# Altium schematic sheet Top Sheet.SchDoc: Title
size B; Organization: Midnight Sun Solar Rayce Car Team; Address1: University of Waterloo; Address2: 200 University Ave W; Address3: Waterloo, ON, Canada; Address4: N2L 3E9; Website: www.uwmidsun.com; ProjectName: ProjectName
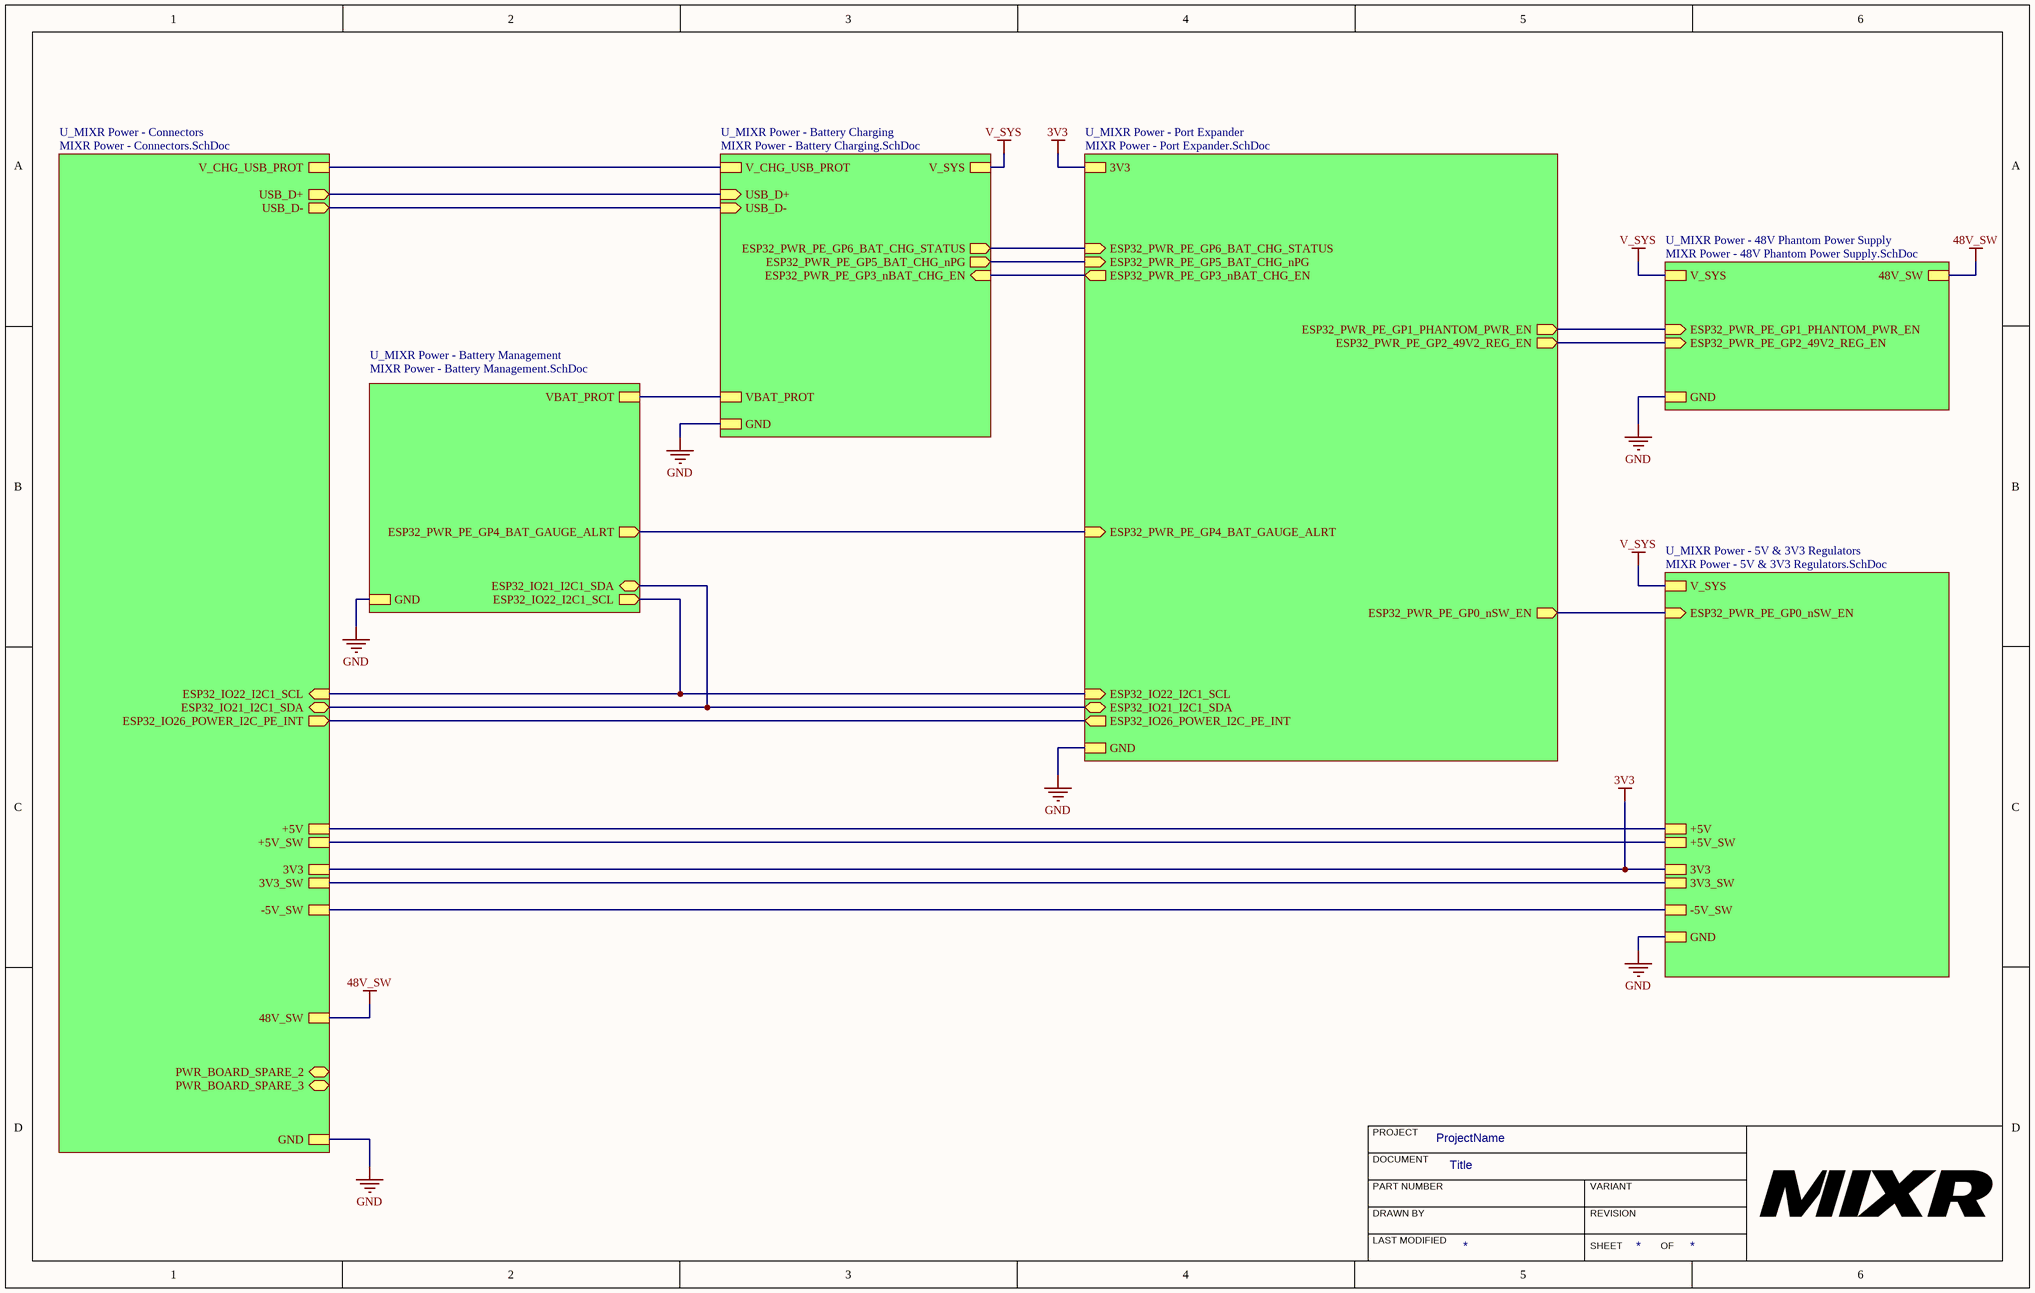
[diagram p0: Top Sheet.SchDoc]

## Sub-sheets
U_MIXR Power - 5V & 3V3 Regulators = MIXR Power - 5V & 3V3 Regulators.SchDoc: ESP32_PWR_PE_GP0_nSW_EN (in), 3V3, -5V_SW, GND, +5V, +5V_SW, 3V3_SW, V_SYS
U_MIXR Power - 48V Phantom Power Supply = MIXR Power - 48V Phantom Power Supply.SchDoc: ESP32_PWR_PE_GP1_PHANTOM_PWR_EN (in), ESP32_PWR_PE_GP2_49V2_REG_EN (in), 48V_SW, V_SYS, GND
U_MIXR Power - Battery Charging = MIXR Power - Battery Charging.SchDoc: USB_D+ (in), USB_D- (in), ESP32_PWR_PE_GP6_BAT_CHG_STATUS (out), ESP32_PWR_PE_GP3_nBAT_CHG_EN (in), ESP32_PWR_PE_GP5_BAT_CHG_nPG (out), VBAT_PROT, GND, V_CHG_USB_PROT, V_SYS
U_MIXR Power - Battery Management = MIXR Power - Battery Management.SchDoc: ESP32_PWR_PE_GP4_BAT_GAUGE_ALRT (out), ESP32_IO21_I2C1_SDA (bidir), ESP32_IO22_I2C1_SCL (out), VBAT_PROT, GND
U_MIXR Power - Connectors = MIXR Power - Connectors.SchDoc: USB_D+ (out), USB_D- (out), 3V3, GND, ESP32_IO21_I2C1_SDA (bidir), +5V, 3V3_SW, +5V_SW, -5V_SW, ESP32_IO22_I2C1_SCL (in), ESP32_IO26_POWER_I2C_PE_INT (out), V_CHG_USB_PROT, 48V_SW, PWR_BOARD_SPARE_2 (bidir), PWR_BOARD_SPARE_3 (bidir)
U_MIXR Power - Port Expander = MIXR Power - Port Expander.SchDoc: ESP32_PWR_PE_GP6_BAT_CHG_STATUS (in), ESP32_PWR_PE_GP3_nBAT_CHG_EN (out), ESP32_IO26_POWER_I2C_PE_INT (out), ESP32_IO21_I2C1_SDA (bidir), ESP32_IO22_I2C1_SCL (in), ESP32_PWR_PE_GP5_BAT_CHG_nPG (in), ESP32_PWR_PE_GP4_BAT_GAUGE_ALRT (in), ESP32_PWR_PE_GP2_49V2_REG_EN (out), ESP32_PWR_PE_GP0_nSW_EN (out), ESP32_PWR_PE_GP1_PHANTOM_PWR_EN (out), 3V3, GND

## Nets
3V3: sheet U_MIXR Power - 5V & 3V3 Regulators/3V3, sheet U_MIXR Power - Port Expander/3V3, sheet U_MIXR Power - Connectors/3V3
48V_SW: sheet U_MIXR Power - 48V Phantom Power Supply/48V_SW, sheet U_MIXR Power - Connectors/48V_SW
GND: sheet U_MIXR Power - 5V & 3V3 Regulators/GND, sheet U_MIXR Power - 48V Phantom Power Supply/GND, sheet U_MIXR Power - Battery Charging/GND, sheet U_MIXR Power - Battery Management/GND, sheet U_MIXR Power - Port Expander/GND, sheet U_MIXR Power - Connectors/GND
V_SYS: sheet U_MIXR Power - 5V & 3V3 Regulators/V_SYS, sheet U_MIXR Power - 48V Phantom Power Supply/V_SYS, sheet U_MIXR Power - Battery Charging/V_SYS
(unnamed): sheet U_MIXR Power - 5V & 3V3 Regulators/ESP32_PWR_PE_GP0_nSW_EN, sheet U_MIXR Power - Port Expander/ESP32_PWR_PE_GP0_nSW_EN
(unnamed): sheet U_MIXR Power - 5V & 3V3 Regulators/-5V_SW, sheet U_MIXR Power - Connectors/-5V_SW
(unnamed): sheet U_MIXR Power - 5V & 3V3 Regulators/+5V, sheet U_MIXR Power - Connectors/+5V
(unnamed): sheet U_MIXR Power - 5V & 3V3 Regulators/+5V_SW, sheet U_MIXR Power - Connectors/+5V_SW
(unnamed): sheet U_MIXR Power - 5V & 3V3 Regulators/3V3_SW, sheet U_MIXR Power - Connectors/3V3_SW
(unnamed): sheet U_MIXR Power - 48V Phantom Power Supply/ESP32_PWR_PE_GP1_PHANTOM_PWR_EN, sheet U_MIXR Power - Port Expander/ESP32_PWR_PE_GP1_PHANTOM_PWR_EN
(unnamed): sheet U_MIXR Power - 48V Phantom Power Supply/ESP32_PWR_PE_GP2_49V2_REG_EN, sheet U_MIXR Power - Port Expander/ESP32_PWR_PE_GP2_49V2_REG_EN
(unnamed): sheet U_MIXR Power - Battery Charging/USB_D+, sheet U_MIXR Power - Connectors/USB_D+
(unnamed): sheet U_MIXR Power - Battery Charging/USB_D-, sheet U_MIXR Power - Connectors/USB_D-
(unnamed): sheet U_MIXR Power - Battery Charging/ESP32_PWR_PE_GP6_BAT_CHG_STATUS, sheet U_MIXR Power - Port Expander/ESP32_PWR_PE_GP6_BAT_CHG_STATUS
(unnamed): sheet U_MIXR Power - Battery Charging/ESP32_PWR_PE_GP3_nBAT_CHG_EN, sheet U_MIXR Power - Port Expander/ESP32_PWR_PE_GP3_nBAT_CHG_EN
(unnamed): sheet U_MIXR Power - Battery Charging/ESP32_PWR_PE_GP5_BAT_CHG_nPG, sheet U_MIXR Power - Port Expander/ESP32_PWR_PE_GP5_BAT_CHG_nPG
(unnamed): sheet U_MIXR Power - Battery Charging/VBAT_PROT, sheet U_MIXR Power - Battery Management/VBAT_PROT
(unnamed): sheet U_MIXR Power - Battery Charging/V_CHG_USB_PROT, sheet U_MIXR Power - Connectors/V_CHG_USB_PROT
(unnamed): sheet U_MIXR Power - Battery Management/ESP32_PWR_PE_GP4_BAT_GAUGE_ALRT, sheet U_MIXR Power - Port Expander/ESP32_PWR_PE_GP4_BAT_GAUGE_ALRT
(unnamed): sheet U_MIXR Power - Battery Management/ESP32_IO21_I2C1_SDA, sheet U_MIXR Power - Port Expander/ESP32_IO21_I2C1_SDA, sheet U_MIXR Power - Connectors/ESP32_IO21_I2C1_SDA
(unnamed): sheet U_MIXR Power - Battery Management/ESP32_IO22_I2C1_SCL, sheet U_MIXR Power - Port Expander/ESP32_IO22_I2C1_SCL, sheet U_MIXR Power - Connectors/ESP32_IO22_I2C1_SCL
(unnamed): sheet U_MIXR Power - Port Expander/ESP32_IO26_POWER_I2C_PE_INT, sheet U_MIXR Power - Connectors/ESP32_IO26_POWER_I2C_PE_INT

## Notes on the sheet
- PROJECT
- DOCUMENT
- DRAWN BY
- LAST MODIFIED
- PART NUMBER
- REVISION
- SHEET
- VARIANT
- OF